# Altium schematic sheet STM32_1_Sheet1.SchDoc
size A4
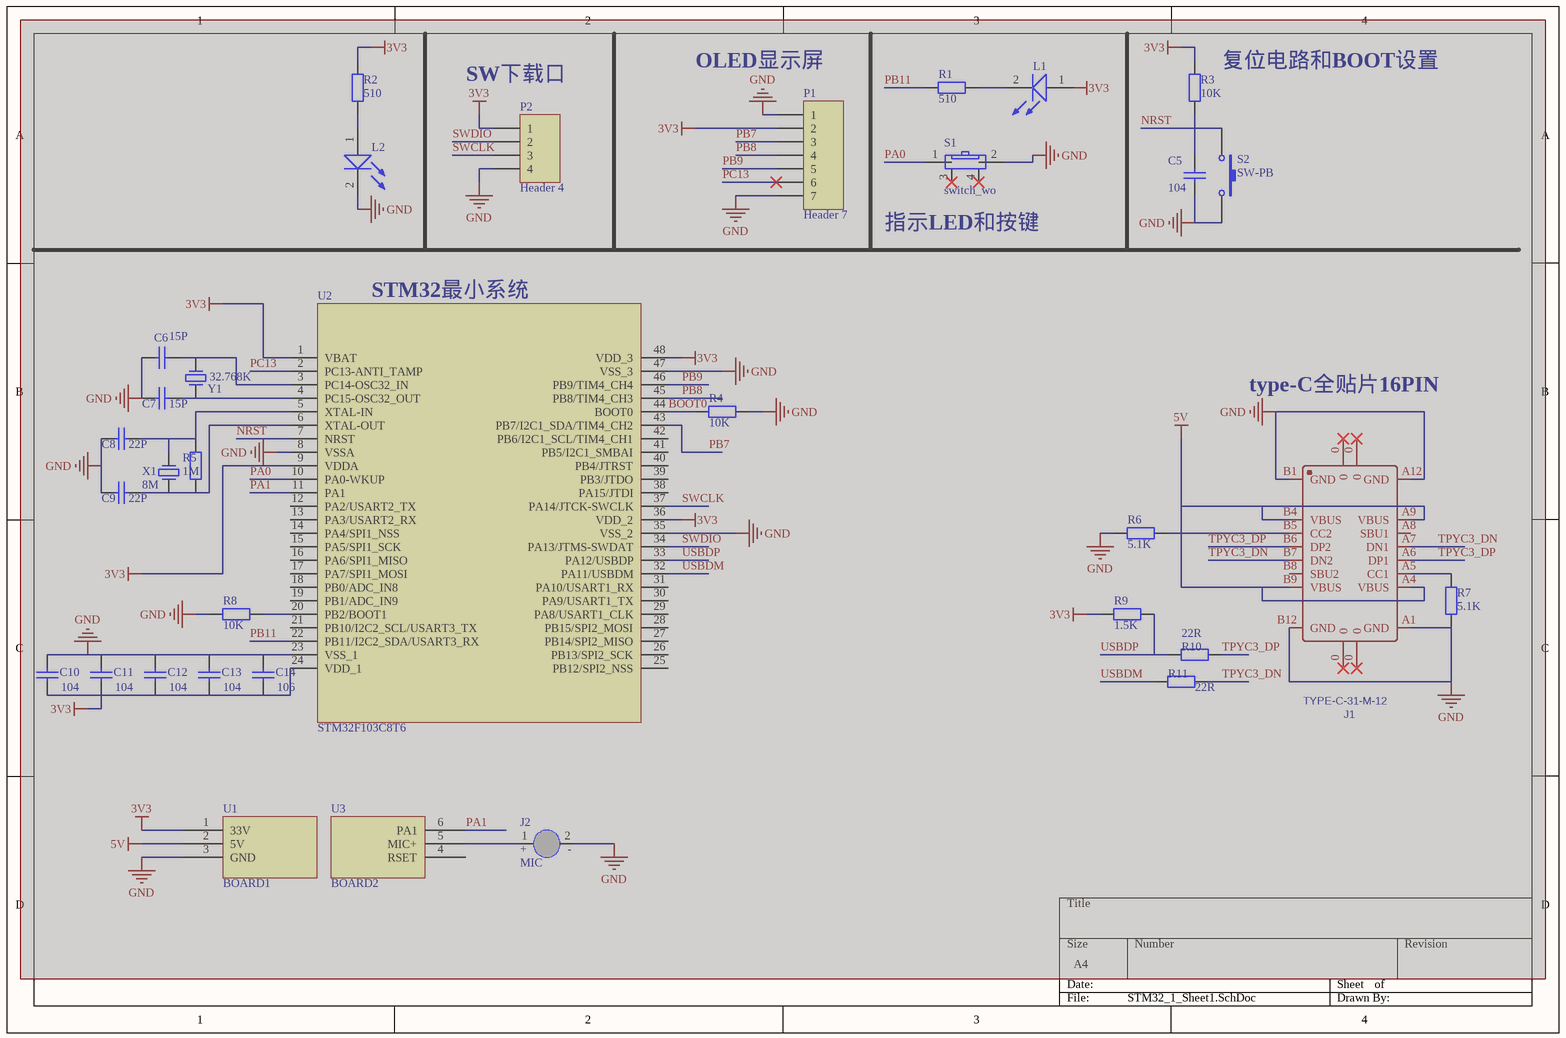
[diagram p0: STM32_1_Sheet1.SchDoc]

## Parts
C5  104  [RC0603]  (masked out: inside a compile mask, not in the netlist)
C6  15P  [RC0603]  (masked out: inside a compile mask, not in the netlist)
C7  15P  [RC0603]  (masked out: inside a compile mask, not in the netlist)
C8  22P  [RC0603]  (masked out: inside a compile mask, not in the netlist)
C9  22P  [RC0603]  (masked out: inside a compile mask, not in the netlist)
C10  104  [RC0603]  (masked out: inside a compile mask, not in the netlist)
C11  104  [RC0603]  (masked out: inside a compile mask, not in the netlist)
C12  104  [RC0603]  (masked out: inside a compile mask, not in the netlist)
C13  104  [RC0603]  (masked out: inside a compile mask, not in the netlist)
C14  106  [RC0805]  (masked out: inside a compile mask, not in the netlist)
J1  TYPE-C-31-M-12  [USB-TYPE-C_16PIN-MALE-TYPE-C-31-M-12]  (masked out: inside a compile mask, not in the netlist)
J2  MIC  [MIC4.5*2.2MMtie]  (masked out: inside a compile mask, not in the netlist)
L1  1  [LED0805]  (value not drawn)  (masked out: inside a compile mask, not in the netlist)
L2  1  [LED0805]  (value not drawn)  (masked out: inside a compile mask, not in the netlist)
P1  Header 7  [HDR1X7]  (masked out: inside a compile mask, not in the netlist)
P2  Header 4  [HDR1X4]  (masked out: inside a compile mask, not in the netlist)
R1  510  [RC0603]  (masked out: inside a compile mask, not in the netlist)
R2  510  [RC0603]  (masked out: inside a compile mask, not in the netlist)
R3  10K  [RC0603]  (masked out: inside a compile mask, not in the netlist)
R4  10K  [RC0603]  (masked out: inside a compile mask, not in the netlist)
R5  1M  [RC0603]  (masked out: inside a compile mask, not in the netlist)
R6  5.1K  [RC0805]  (masked out: inside a compile mask, not in the netlist)
R7  5.1K  [RC0805]  (masked out: inside a compile mask, not in the netlist)
R8  10K  [RC0603]  (masked out: inside a compile mask, not in the netlist)
R9  1.5K  [RC0805]  (masked out: inside a compile mask, not in the netlist)
R10  22R  [RC0603]  (masked out: inside a compile mask, not in the netlist)
R11  22R  [RC0603]  (masked out: inside a compile mask, not in the netlist)
S1  switch_wo  [SW-SMD-4X2X2侧]  (masked out: inside a compile mask, not in the netlist)
S2  SW-PB  [SMT-KEY]  (masked out: inside a compile mask, not in the netlist)
U1  BOARD1  [board1dan]  (masked out: inside a compile mask, not in the netlist)
U2  STM32F103C8T6  [LQFP48]  (masked out: inside a compile mask, not in the netlist)
U3  BOARD2  [board2-dan]  (masked out: inside a compile mask, not in the netlist)
X1  8M  [OSC 5032-2P]  (masked out: inside a compile mask, not in the netlist)
Y1  32.768K  [OSC 3215-2P]  (masked out: inside a compile mask, not in the netlist)

## Notes on the sheet
- (near P2) SW下载口
- (near P1) OLED显示屏
- (near R3) 复位电路和BOOT设置
- (near S1) 指示LED和按键
- STM32最小系统
- type-C全贴片16PIN
- (in symbol MIC) +; -

## Library data of the parts
C5-C14 = Cap: Capacitor; Published: 8-Jun-2000; LatestRevisionDate: 17-Jul-2002; LatestRevisionNote: Re-released for DXP Platform.; PackageReference: RAD-0.3; Publisher: Altium Limited; PackageDescription: Radial Cap, Thru-Hole; 2 Leads; 0.3 in Pin Spacing
  C5 C10-C13: Value: 104
  C6 C7: Value: 15P
  C8 C9: Value: 22P
  C14: Value: 106
J2 = MIC: 咪头
L1 L2 = LED
P1 = Header 7: Header, 7-Pin; LatestRevisionDate: 17-Jul-2002; LatestRevisionNote: Re-released for DXP Platform.; Publisher: Altium Limited
P2 = Header 4: Header, 4-Pin; LatestRevisionDate: 17-Jul-2002; LatestRevisionNote: Re-released for DXP Platform.; Publisher: Altium Limited
R1-R11 = Res2: Resistor; Published: 8-Jun-2000; LatestRevisionDate: 17-Jul-2002; LatestRevisionNote: Re-released for DXP Platform.; PackageReference: AXIAL-0.4; Publisher: Altium Limited; PackageDescription: Axial Device, Thru-Hole; 2 Leads; 0.4 in Pin Spacing
  R3 R4 R8: Value: 10K
  R5: Value: 1M
  R6 R7: Value: 5.1K
  R9: Value: 1.5K
  R10 R11: Value: 22R
S1 = switch_wo: 卧式开关
S2 = SW-PB: Switch; Published: 24-Mar-1999; LatestRevisionDate: 17-Jul-2002; LatestRevisionNote: Re-released for DXP Platform.; PackageReference: SPST-2; Publisher: Altium Limited; PackageDescription: Switch; 2 Leads
U2 = STM32F103C8T6: STM32
X1 Y1 = Y1: 晶振